# Altium schematic sheet FEU31_Part2.SchDoc: Интерфейсный модуль ФЭУ-102
size A3; Address1: (с) Быканов Андрей; Address2: г.Тула 2016г.; Revision: 1.3
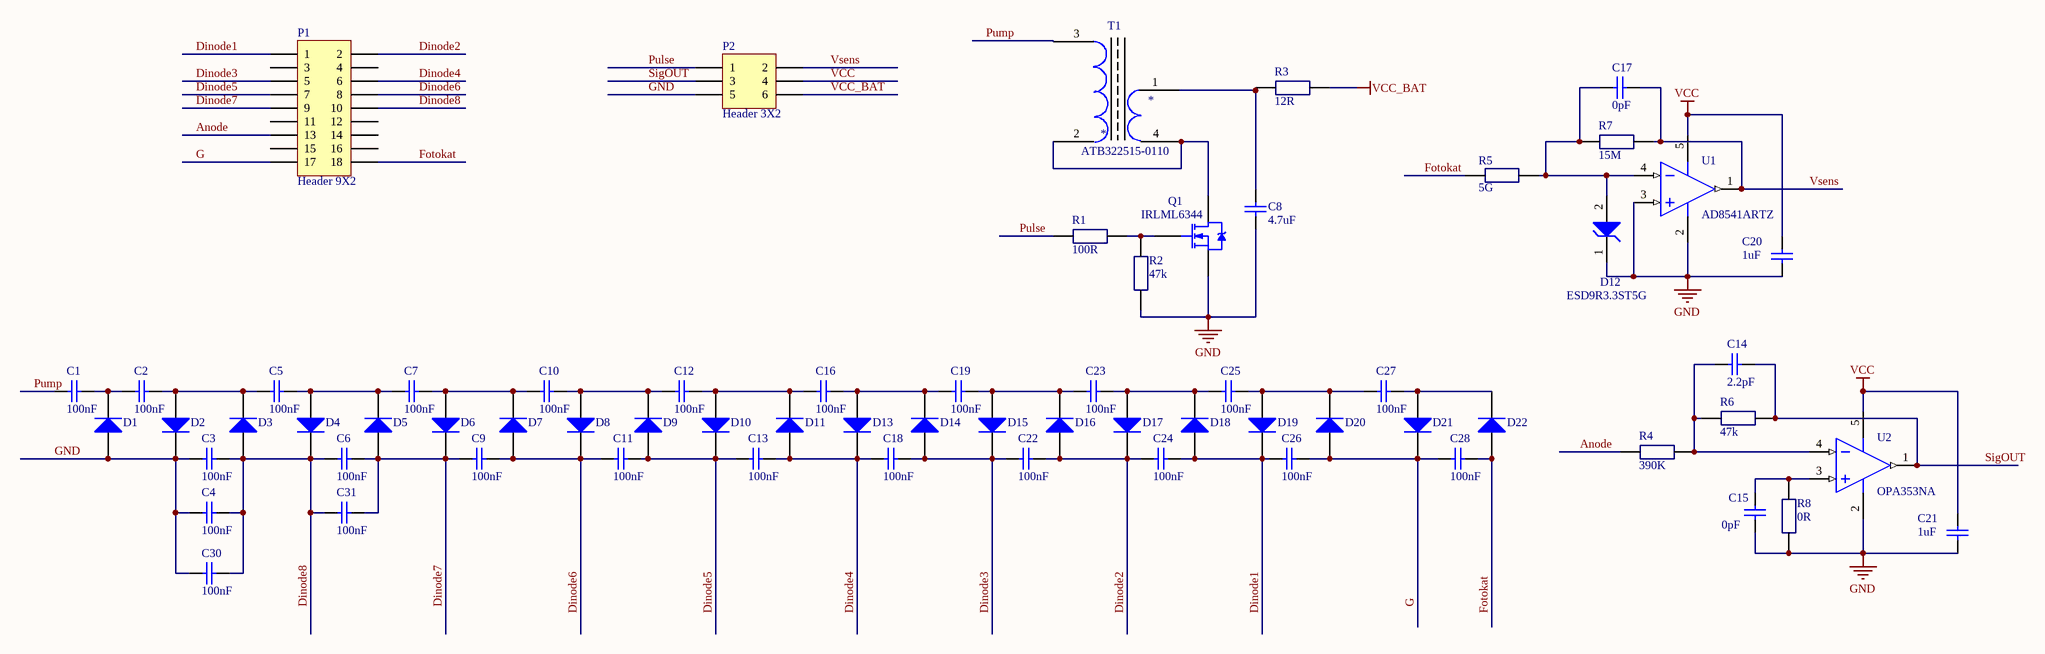
[diagram p0: FEU31_Part2.SchDoc]

## Parts
C1  100nF  [C1206]
C2  100nF  [C1206]
C3  100nF  [C1206]
C4  100nF  [C1206]
C5  100nF  [C1206]
C6  100nF  [C1206]
C7  100nF  [C1206]
C8  4.7uF  [C1206]
C9  100nF  [C1206]
C10  100nF  [C1206]
C11  100nF  [C1206]
C12  100nF  [C1206]
C13  100nF  [C1206]
C14  2.2pF  [1608[0603]]
C15  0pF  [1608[0603]_CAP]
C16  100nF  [C1206]
C17  0pF  [1608[0603]]
C18  100nF  [C1206]
C19  100nF  [C1206]
C20  1uF  [1608[0603]_CAP]
C21  1uF  [1608[0603]_CAP]
C22  100nF  [C1206]
C23  100nF  [C1206]
C24  100nF  [C1206]
C25  100nF  [C1206]
C26  100nF  [C1206]
C27  100nF  [C1206]
C28  100nF  [C1206]
C30  100nF  [C1206]
C31  100nF  [C1206]
D1  (no value)  [DA2JF8100L]
D2  (no value)  [DA2JF8100L]
D3  (no value)  [DA2JF8100L]
D4  (no value)  [DA2JF8100L]
D5  (no value)  [DA2JF8100L]
D6  (no value)  [DA2JF8100L]
D7  (no value)  [DA2JF8100L]
D8  (no value)  [DA2JF8100L]
D9  (no value)  [DA2JF8100L]
D10  (no value)  [DA2JF8100L]
D11  (no value)  [DA2JF8100L]
D12  ESD9R3.3ST5G  [ONSC-SOD-923-2-514AB-01_V]
D13  (no value)  [DA2JF8100L]
D14  (no value)  [DA2JF8100L]
D15  (no value)  [DA2JF8100L]
D16  (no value)  [DA2JF8100L]
D17  (no value)  [DA2JF8100L]
D18  (no value)  [DA2JF8100L]
D19  (no value)  [DA2JF8100L]
D20  (no value)  [DA2JF8100L]
D21  (no value)  [DA2JF8100L]
D22  (no value)  [DA2JF8100L]
P1  Header 9X2  [R1306-19]  (no BOM)
P2  Header 3X2  [HDR2X3]  (no BOM)
Q1  IRLML6344  [SOT-23_N]
R1  100R  [1608[0603]_RES]
R2  47k  [1608[0603]_RES]
R3  12R  [1608[0603]_RES]
R4  390K  [1608[0603]_RES]
R5  5G  [HVF2512T5007FE]
R6  47k  [1608[0603]_RES]
R7  15M  [1608[0603]_RES]
R8  0R  [1608[0603]_RES]
T1  ATB322515-0110  [ATB322515-0110]
U1  AD8541ARTZ  [ADI-RJ-5_N]
U2  OPA353NA  [ADI-RJ-5_N]

## Nets
GND: C3.2 C4.2 C8.2 C15.2 C20.2 C21.2 C30.2 D1.1(A) D2.2(K) D12.1(K) P2.5 Q1.2(S) R2.1(A) R8.1(A) U1.2(-V) U1.3(+IN_A) U2.2(-V)
VCC: C20.1 C21.1 P2.4 U1.5(+V) U2.5(+V)
VCC_BAT: P2.6 R3.2
Anode: P1.13 R4.2
Dinode1: C24.1 C26.2 D18.1(A) D19.2(K) P1.1
Dinode2: C22.1 C24.2 D16.1(A) D17.2(K) P1.2
Dinode3: C18.1 C22.2 D14.1(A) D15.2(K) P1.5
Dinode4: C13.1 C18.2 D11.1(A) D13.2(K) P1.6
Dinode5: C11.1 C13.2 D9.1(A) D10.2(K) P1.7
Dinode6: C9.1 C11.2 D7.1(A) D8.2(K) P1.8
Dinode7: C6.1 C9.2 C31.1 D5.1(A) D6.2(K) P1.9
Dinode8: C3.1 C4.1 C6.2 C30.1 C31.2 D3.1(A) D4.2(K) P1.10
Fotokat: C28.1 D22.1(A) P1.18 R5.1(A)
G: C26.1 C28.2 D20.1(A) D21.2(K) P1.17
Pulse: P2.1 R1.1(A)
Pump: C1.2 T1.3
SigOUT: C14.2 P2.3 R6.2 U2.1(OUT_A)
Vsens: C17.2 P2.2 R7.2 U1.1(OUT_A)
NetC1_1: C1.1 C2.2 D1.2(K)
NetC2_1: C2.1 C5.2 D2.1(A) D3.2(K)
NetC5_1: C5.1 C7.2 D4.1(A) D5.2(K)
NetC7_1: C7.1 C10.2 D6.1(A) D7.2(K)
NetC8_1: C8.1 R3.1(A) T1.1
NetC10_1: C10.1 C12.2 D8.1(A) D9.2(K)
NetC12_1: C12.1 C16.2 D10.1(A) D11.2(K)
NetC14_1: C14.1 R4.1(A) R6.1(A) U2.4(-IN_A)
NetC15_1: C15.1 R8.2 U2.3(+IN_A)
NetC16_1: C16.1 C19.2 D13.1(A) D14.2(K)
NetC17_1: C17.1 D12.2(A) R5.2 R7.1(A) U1.4(-IN_A)
NetC19_1: C19.1 C23.2 D15.1(A) D16.2(K)
NetC23_1: C23.1 C25.2 D17.1(A) D18.2(K)
NetC25_1: C25.1 C27.2 D19.1(A) D20.2(K)
NetC27_1: C27.1 D21.1(A) D22.2(K)
NetQ1_1: Q1.1(G) R1.2 R2.2
NetQ1_3: Q1.3(D) T1.2 T1.4

Not connected (* = marked no-connect by the designer): P1 3 4 11 12 14 15 16

## Notes on the sheet
- Title
- Size:
- Date:
- A3
- Number:
- Time:
- Revision:
- Sheet
- of
- File:

## Library data of the parts
C1-C7 C9-C13 C16 C18 C19 C22-C28 C30 C31 = Cap Semi: Capacitor (Semiconductor SIM Model); Order: CGA5L4X7T2W104K; Published: 8-Jun-2000; LatestRevisionDate: 29-May-2009; LatestRevisionNote: IPC-7351 Footprint Added.; PackageReference: C1206; Publisher: Altium Limited; PackageDescription: Chip Capacitor; Value: 100nF
C8 = Cap Semi: Capacitor (Semiconductor SIM Model); Order: CC1206KKX7R8BB475; Published: 8-Jun-2000; LatestRevisionDate: 29-May-2009; LatestRevisionNote: IPC-7351 Footprint Added.; PackageReference: C1206; Publisher: Altium Limited; PackageDescription: Chip Capacitor; Value: 4.7uF
C14 = Cap Semi: Capacitor (Semiconductor SIM Model); Order: CC0603CRNPO9BN2R2; Published: 8-Jun-2000; LatestRevisionDate: 29-May-2009; LatestRevisionNote: IPC-7351 Footprint Added.; PackageReference: C1206; Publisher: Altium Limited; PackageDescription: Chip Capacitor; Value: 2.2pF
C15 C17 = Cap Semi: Capacitor (Semiconductor SIM Model); Order: none; Published: 8-Jun-2000; LatestRevisionDate: 29-May-2009; LatestRevisionNote: IPC-7351 Footprint Added.; PackageReference: C1206; Publisher: Altium Limited; PackageDescription: Chip Capacitor; Value: 0pF
C20 C21 = Cap Semi: Capacitor (Semiconductor SIM Model); Order: CC0603KRX5R7BB105; Published: 8-Jun-2000; LatestRevisionDate: 29-May-2009; LatestRevisionNote: IPC-7351 Footprint Added.; PackageReference: C1206; Publisher: Altium Limited; PackageDescription: Chip Capacitor; Value: 1uF
D1-D11 D13-D22 = Diode: Default Diode; Value: DA2JF8100L; Published: 8-Jun-2000; LatestRevisionDate: 17-Jul-2002; LatestRevisionNote: Re-released for DXP Platform.; PackageVersion: Sep-1996; PackageReference: SMC; Publisher: Altium Limited; PackageDescription: DO-214-AB/SMC; 2 C-Bend Leads; Body 7.9 x 5.9 mm, inc. leads (LxW); Code_JEDEC: DO-214-AB; Order: DA2JF8100L
D12 = ESD9R3.3ST5G: Transient Voltage Suppressor, ESD Protection Diode with Ultra-Low Leakage, 2-Pin SOD-923, Pb-Free, Tape and Reel; Manufacturer: On Semiconductor; C Max (pF): 0.9; Direction: Unidirectional; IR Max (uA): 0.001; Number of Lines: 1; V(BR) Min (V): 4.8; VRWM Max (V): 3.3; DatasheetVersion: Rev. 1; PackageVersion: Rev. C, 03/2011; PackageReference: SOD-923-2-514AB-01; PackageDescription: 2-Pin SOD, Body 0.8 x 0.6 mm; Supplier 1: Digi-Key; Supplier Part Number 1: ESD9R3.3ST5GOSTR-ND; Supplier 2: Digi-Key; Supplier Part Number 2: ESD9R3.3ST5GOSCT-ND; Supplier 3: Digi-Key; Supplier Part Number 3: ESD9R3.3ST5GOSDKR-ND; Supplier 4: Farnell; Supplier Part Number 4: 2101835; Supplier 5: Mouser; Supplier Part Number 5: 863-ESD9R3.3ST5G; Packing: Tape and Reel; RoHS: Pb-Free; Mounting Technology: Surface Mount; PartNumber: ESD9R3.3ST5G; ComponentLink1Description: Manufacturer URL; ComponentLink1URL: http://www.onsemi.com/; ComponentLink2Description: Datasheet; ComponentLink2URL: http://www.onsemi.com/pub_link/Collateral/ESD9R3.3S-D.PDF; ComponentLink3Description: Package Specification; ComponentLink3URL: http://www.onsemi.com/pub_link/Collateral/514AB.PDF; Order: ESD9R3.3ST5G
P1 = Header 9X2: Header, 9-Pin, Dual row; LatestRevisionDate: 17-Jul-2002; LatestRevisionNote: Re-released for DXP Platform.; Publisher: Altium Limited
P2 = Header 3X2: Header, 3-Pin, Dual row; LatestRevisionDate: 17-Jul-2002; LatestRevisionNote: Re-released for DXP Platform.; Publisher: Altium Limited
Q1 = IRLML2402: HEXFET Power MOSFET; Published: 8-Jun-2000; LatestRevisionDate: 20-Nov-2009; LatestRevisionNote: IPC-7351 Footprint Added.; DatasheetVersion: Aug-1997; PackageReference: SOT-23; Publisher: Altium Limited; PackageDescription: 3-Pin SOT-23 Package 0.95 mm Pitch, 2.3 mm Lead Span; ComponentLink1Description: Manufacturer Link; ComponentLink1URL: http://www.irf.com/; ComponentLink2Description: Datasheet; ComponentLink2URL: http://www.irf.com/product-info/datasheets/data/irlml2402.pdf; Order: IRLML6344
R1 = Resistor 0805: Order: RC0603JR-07100RL; Avail: 20; Value: 100R
R2 = Resistor 0805: Order: RC0603FR-0747KL; Avail: 20; Value: 47k
R3 = Resistor 0805: Order: ERJ3GEYJ120V; Avail: 20; Value: 12R
R4 = Resistor 0805: Order: RC0603FR-07390KL; Avail: 20; Value: 390K
R5 = Resistor 0805: Order: HVF2512T5007FE; Value: 5G
R6 = Resistor 0805: Order: RC0603FR-0747KL; Value: 47k
R7 = Resistor 0805: Order: RC0603FR-0715ML; Value: 15M
R8 = Resistor 0805: Order: RC0603JR-070RL; Value: 0R
U1 U2 = AD8541ARTZ-R2: Single Channel RRIO Operational Amplifier, 1 MHz BW, 920 mV/us SR, Industrial, 5-pin SOT23 (RJ-5), Reel; Generic Part Number: AD8541; Manufacturer: Analog Devices; Amplifiers Per Package: 1; Input Bias Current: 4pA; Input Offset Voltage: 1mV; Iq/Amp: 65uA; Small Signal Bandwidth: 1MHz; V Span Max: 5.5V; V Span Min: 2.7V; DatasheetVersion: Rev. G; PackageVersion: 121608-A; PackageReference: RJ-5; PackageDescription: 5-Pin Small Outline Transistor Package, Body 2.9 x 1.6 mm, Pitch 0.95 mm; Supplier 1: Digi-Key; Supplier Part Number 1: AD8541ARTZ-R2TR-ND; Supplier 2: Digi-Key; Supplier Part Number 2: AD8541ARTZ-R2CT-ND; Supplier 3: Digi-Key; Supplier Part Number 3: AD8541ARTZ-R2DKR-ND; Supplier 4: Farnell; Supplier Part Number 4: 1837434; Supplier 5: Newark; Supplier Part Number 5: 59K6820; Slew Rate: 920mV/us; Mounting Technology: Surface Mount; Code_JEDEC: MO-178-AA; PartNumber: AD8541ARTZ-R2; ComponentLink1Description: Manufacturer URL; ComponentLink1URL: http://www.analog.com/en/index.html; ComponentLink2Description: Datasheet; ComponentLink2URL: http://www.analog.com/static/imported-files/data_sheets/AD8541_8542_8544.pdf; ComponentLink3Description: Package Specification; ComponentLink3URL: http://www.analog.com/static/imported-files/packages/PKG_PDF/SOT-23(RJ)/RJ_5.pdf; ComponentLink4Description: Reference Circuit; ComponentLink4URL: http://www.analog.com/en/all-operational-amplifiers-op-amps/operational-amplifiers-op-amps/ad8541/products/product.html#product-recommendations
  U1: Order: AD8541ARTZ
  U2: Order: OPA353NA